# EAGLE schematic power (EAGLE 6.5.0)
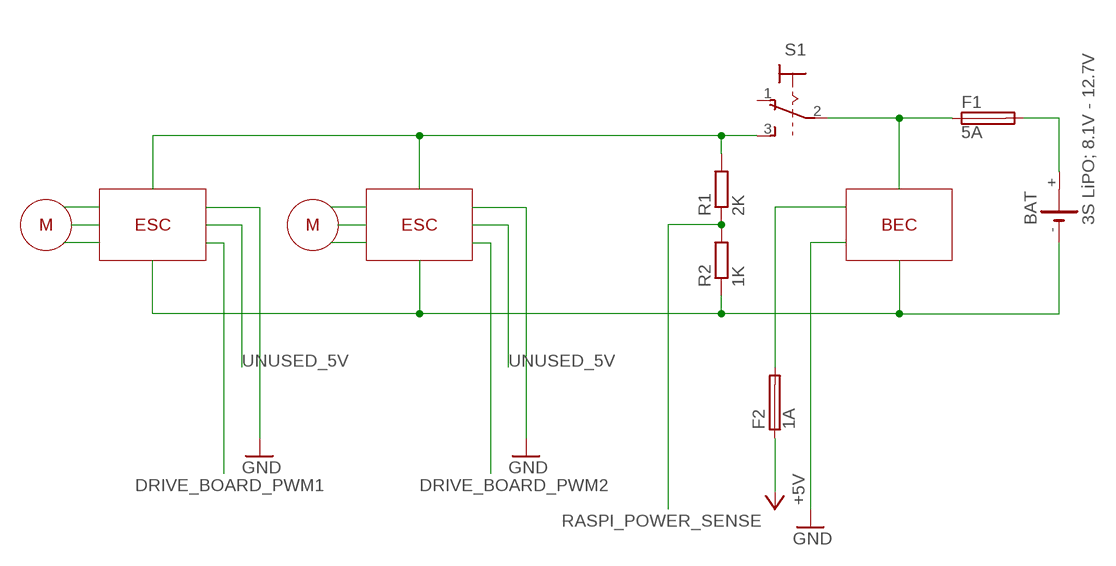
[diagram p0: schematic, sheet 1]

## Parts
BAT  3S LiPO; 8.1V - 12.7V  1V60R  [1V60R]
F1  5A  FUSE1821  [FUSE_HOLDER_MENTOR-1821]
F2  1A  FUSE1821  [FUSE_HOLDER_MENTOR-1821]
R1  2K  R-EU_0204/2V  [0204V]
R2  1K  R-EU_0204/2V  [0204V]
S1  320-938  [320-938]

## Nets
+5V: F2.A
N$1: BAT.+ F1.B
N$2: F1.A S1.2(1:P)
N$3: R1.2 S1.3(1:S)
N$4: F2.B
N$5: BAT.- R2.1
RASPI_POWER_SENSE: R1.1 R2.2
Unconnected: BAT.+@1(+) S1.1(1:O) S1.4(B:O) S1.5(B:P) S1.6(B:S)

## Notes on the sheet
- M | ESC | M | ESC | BEC

## Library data of the parts
BAT = battery:1V60R: NC ACCU Varta
F1 F2 = fuse:FUSE: Fuse; OC_FARNELL: unknown; OC_NEWARK: unknown
R1 R2 = rcl:R-EU_: RESISTOR, European symbol
S1 = switch:320-938: TOGGLE SWITCH distributor RS Components